# Altium project MCP2515 Module.PrjPcb
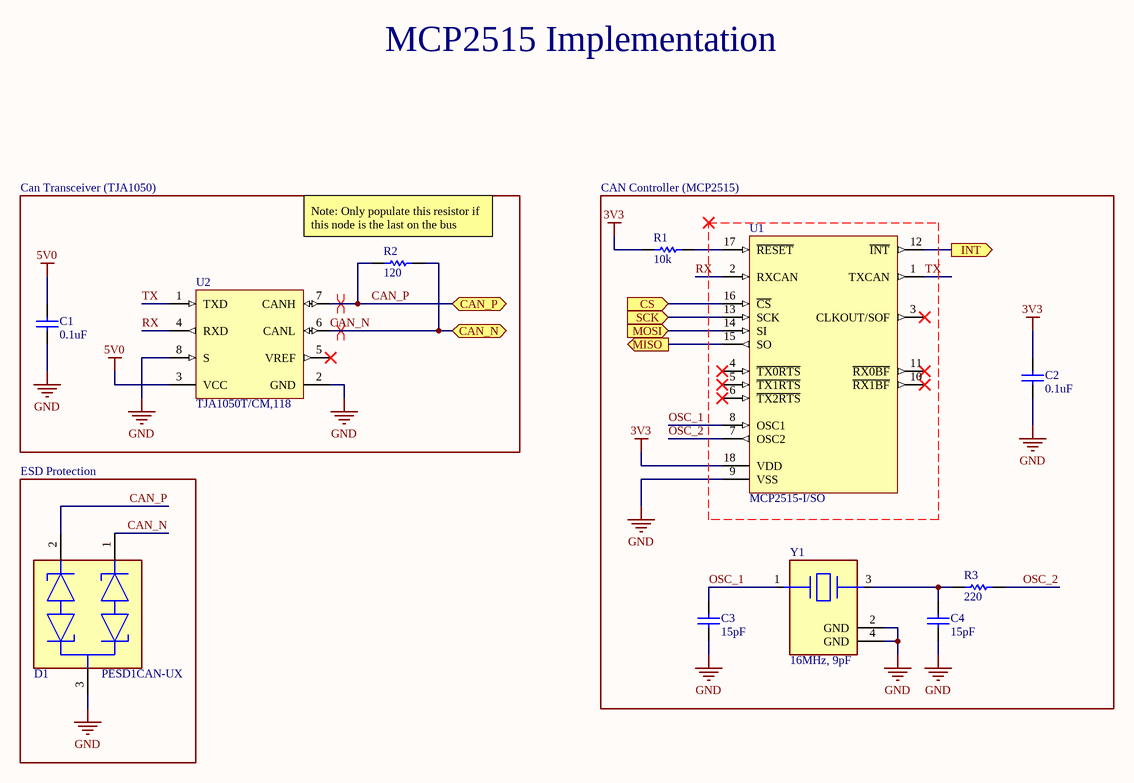
[diagram p0: MCP2515 Module.SchDoc]
1 sheet, 11 parts. Net scope: flat (ports and power ports of the same name join across sheets).

## Sheet MCP2515 Module.SchDoc
size A4

### Parts
C1  0.1uF  [CAPC2013X88X50NL20T25]
C2  0.1uF  [CAPC2013X88X50NL20T25]
C3  15pF  [CAPC2013X140X50LL20T25]
C4  15pF  [CAPC2013X140X50LL20T25]
D1  PESD1CAN-UX  [FP-SOT323-MFG]
R1  10k  [RESC2013X60X40LL20T25_A]
R2  120  [RESC2013X70X40NL20T20]
R3  220  [RESC2013X70X40NL20T20]
U1  MCP2515-I/SO  [SOIC-SO18_L]
U2  TJA1050T/CM,118  [NXP-SOT96-1_M]
Y1  16MHz, 9pF  [FP-TSX-3225-MFG]

### Blocks framed on the sheet
Can Transceiver (TJA1050): C1 R2 U2
CAN Controller (MCP2515): C2-C4 R1 R3 U1 Y1
ESD Protection: D1

### Ports
CAN_N (bidir), CAN_P (bidir), CS (in), INT (out), MISO (out), MOSI (in), SCK (in)

### Nets
3V3: C2.2 R1.1 U1.18(VDD)
5V0: C1.2 U2.3(VCC)
GND: C1.1 C2.1 C3.2 C4.2 D1.3(common_cathode) U1.9(VSS) U2.2(GND) U2.8(S) Y1.2(GND) Y1.4(GND)
CAN_N: D1.1(cathode_1) R2.2 U2.6(CANL) ; port CAN_N
CAN_P: D1.2(cathode_2) R2.1 U2.7(CANH) ; port CAN_P
OSC_1: C3.1 U1.8(OSC1) Y1.1
OSC_2: R3.1 U1.7(OSC2)
RX: U1.2(RXCAN) U2.4(RXD)
TX: U1.1(TXCAN) U2.1(TXD)
NetC4_1: C4.1 R3.2 Y1.3
NetR1_2: R1.2 U1.17(~{RESET})
NetU1_12: U1.12(~{INT}) ; port INT
NetU1_13: U1.13(SCK) ; port SCK
NetU1_14: U1.14(SI) ; port MOSI
NetU1_15: U1.15(SO) ; port MISO
NetU1_16: U1.16(~{CS}) ; port CS

Not connected (* = marked no-connect by the designer): U1 3(CLKOUT/SOF)* 4(~{TX0RTS})* 5(~{TX1RTS})* 6(~{TX2RTS})* 10(~{RX1BF})* 11(~{RX0BF})*; U2 5(VREF)*

### Layout directives
differential pair: CAN_N, CAN_P

### Notes on the sheet
- MCP2515 Implementation
- (near R2) Note: Only populate this resistor if this node is the last on the bus

### Library data of the parts
C1 C2 = CMP-2007-00279-1: Part Number: C0805C104K5RACTU; Manufacturer: Kemet; Dielectric Material: Ceramic; Capacitance: 100nF; Tolerance: 10%; Voltage Rating: 50V; Dielectric: X7R; Voltage: 500V; Supplier 1: LCSC; Supplier Part Number 1: C129690; Manufacturer Part Number: C0805C104K5RACTU; RoHS: Yes; Category: Ceramic Capacitors; Stock 1: 744050; Pricing 1: 50=0.02360, 500=0.01780, 1500=0.01680, 5000=0.01570, 25000=0.01530, 50000=0.01500, 50=0.02250, 500=0.01700, 1500=0.01600, 5000=0.01500, 25000=0.01460, 50000=0.01430, 50=0.11760, 500=0.08890, 1500=0.08370, 5000=0.07840, 25000=0.07610, 50000=0.07490, 50=0.10700, 500=0.08090, 1500=0.07610, 5000=0.07130, 25000=0.06920, 50000=0.06810, 50=0.01440, 500=0.01090, 1500=0.01020, 5000=0.00960, 25000=0.00930, 50000=0.00920, 50=0.01310, 500=0.00990, 1500=0.00930, 5000=0.00870, 25000=0.00850, 50000=0.00830, 50=0.13020, 500=0.09850, 1500=0.09270, 5000=0.08680, 25000=0.08420, 50000=0.08300, 50=1.77600, 500=1.34310, 1500=1.26360, 5000=1.18400, 25000=1.14870, 50000=1.13130, 50=0.07150, 500=0.05410, 1500=0.05090, 5000=0.04770, 25000=0.04620, 50000=0.04550, 50=1.20420, 500=0.91060, 1500=0.85670, 5000=0.80280, 25000=0.77880, 50000=0.76700, 50=0.14790, 500=0.11180, 1500=0.10520, 5000=0.09860, 25000=0.09570, 50000=0.09420, 50=0.02320, 500=0.01750, 1500=0.01650, 5000=0.01550, 25000=0.01500, 50000=0.01480, 50=0.01680, 500=0.01271, 1500=0.01196, 5000=0.01120, 25000=0.01087, 50000=0.01070 (AUD); Mount: Surface Mount,PCB; Case/Package: 0805; Number of Pins: 2; Case Code (Imperial): 0805; Case Code (Metric): 2012; Contact Plating: Tin,Matte; Min Operating Temperature: -55°C; Max Operating Temperature: 125°C; Packaging: Tape and Reel; Termination: SMD/SMT; Package Quantity: 4000; Voltage Rating (DC): 50V; Length: 2mm; Height: 0.9mm; Depth: 1.25mm; Width: 1.2mm; Thickness: 0.035inch; Lead Pitch: 0.75mm; Radiation Hardening: No; REACH SVHC: No SVHC; ComponentLink1URL: https://datasheet.ciiva.com/14589/70095383-14589048.pdf?src-supplier=Allied+Electronics; ComponentLink1Description: https://datasheet.ciiva.com/14589/70095383-14589048.pdf?src-supplier=Allied+Electronics; ComponentLink2URL: https://datasheet.ciiva.com/28682/1851736-28682232.pdf?src-supplier=Element14; ComponentLink2Description: https://datasheet.ciiva.com/28682/1851736-28682232.pdf?src-supplier=Element14; ComponentLink3URL: https://datasheet.ciiva.com/32431/slceramic-chip-condensers-e-32431755.pdf?src-supplier=Distrelec; ComponentLink3Description: https://datasheet.ciiva.com/32431/slceramic-chip-condensers-e-32431755.pdf?src-supplier=Distrelec; ComponentLink4URL: https://datasheet.ciiva.com/18410/70095383-18410815.pdf?src-supplier=Allied+Electronics; ComponentLink4Description: https://datasheet.ciiva.com/18410/70095383-18410815.pdf?src-supplier=Allied+Electronics; Supplier 2: Digi-Key; Supplier Part Number 2: 399-1170-1-ND; Stock 2: 2736847; Pricing 2: 1=0.16000, 10=0.11500, 50=0.06540, 100=0.05420, 500=0.03802, 1000=0.03147 (USD)
C3 C4 = CMP-2007-04621-1: Part Number: 08055A150JAT2A; Manufacturer: AVX Interconnect / Elco; Dielectric Material: Ceramic; Voltage Rating: 50V; Tolerance: 5%; Dielectric: C0G; Temperature Coefficient: 0ppm/°C; Supplier 1: LCSC; Supplier Part Number 1: C597359; Manufacturer Part Number: 08055A150JAT2A; RoHS: Yes; Category: Ceramic Capacitors; Stock 1: 3620; Pricing 1: 20=0.03110, 200=0.02350, 600=0.02210, 2000=0.02070, 10000=0.02010, 20000=0.01980, 20=0.02970, 200=0.02250, 600=0.02110, 2000=0.01980, 10000=0.01920, 20000=0.01890, 20=0.15140, 200=0.11430, 600=0.10750, 2000=0.10070, 10000=0.09770, 20000=0.09620, 20=0.14090, 200=0.10640, 600=0.10010, 2000=0.09370, 10000=0.09090, 20000=0.08950, 20=0.01890, 200=0.01430, 600=0.01340, 2000=0.01260, 10000=0.01220, 20000=0.01200, 20=0.01730, 200=0.01300, 600=0.01230, 2000=0.01150, 10000=0.01110, 20000=0.01100, 20=0.17220, 200=0.13010, 600=0.12230, 2000=0.11460, 10000=0.11110, 20000=0.10940, 20=2.34860, 200=1.77360, 600=1.66800, 2000=1.56230, 10000=1.51540, 20000=1.49220, 20=0.09240, 200=0.06980, 600=0.06560, 2000=0.06140, 10000=0.05960, 20000=0.05870, 20=1.75290, 200=1.32370, 600=1.24490, 2000=1.16600, 10000=1.13100, 20000=1.11370, 20=0.19920, 200=0.15040, 600=0.14140, 2000=0.13250, 10000=0.12850, 20000=0.12650, 20=0.03040, 200=0.02300, 600=0.02160, 2000=0.02020, 10000=0.01960, 20000=0.01930, 20=0.02222, 200=0.01678, 600=0.01578, 2000=0.01478, 10000=0.01434, 20000=0.01412 (AUD); Mount: Surface Mount,PCB; Case/Package: 0805; Number of Pins: 2; Case Code (Metric): 2012; Case Code (Imperial): 0805; Contact Plating: Tin,Matte; Min Operating Temperature: -55°C; Max Operating Temperature: 125°C; Capacitance: 15pF; Packaging: Tape and Reel; Voltage Rating (DC): 50V; Package Quantity: 1; Termination: SMD/SMT; Voltage: 50V; Length: 2.01mm; Height: 0.71mm; Depth: 1.25mm; Width: 0.049inch; Thickness: 0.037inch; Radiation Hardening: No; Lead Free: Lead Free; REACH SVHC: No SVHC; ComponentLink1URL: https://datasheet.ciiva.com/150/ccog-150608.pdf?src-supplier=Digi-Key; ComponentLink1Description: https://datasheet.ciiva.com/150/ccog-150608.pdf?src-supplier=Digi-Key; ComponentLink2URL: https://datasheet.ciiva.com/150/ccog-150609.pdf?src-supplier=Digi-Key; ComponentLink2Description: https://datasheet.ciiva.com/150/ccog-150609.pdf?src-supplier=Digi-Key; ComponentLink3URL: https://datasheet.ciiva.com/150/ccog-150610.pdf?src-supplier=Digi-Key; ComponentLink3Description: https://datasheet.ciiva.com/150/ccog-150610.pdf?src-supplier=Digi-Key; ComponentLink4URL: https://datasheet.ciiva.com/16537/ccog-16537029.pdf?src-supplier=Avnet+Asia; ComponentLink4Description: https://datasheet.ciiva.com/16537/ccog-16537029.pdf?src-supplier=Avnet+Asia; ComponentLink5URL: https://datasheet.ciiva.com/22676/759117-22676981.pdf?src-supplier=Element14; ComponentLink5Description: https://datasheet.ciiva.com/22676/759117-22676981.pdf?src-supplier=Element14; ComponentLink6URL: https://datasheet.ciiva.com/2987/ccog-2987979.pdf?src-supplier=Avnet; ComponentLink6Description: https://datasheet.ciiva.com/2987/ccog-2987979.pdf?src-supplier=Avnet; ComponentLink7URL: https://datasheet.ciiva.com/17492/ccog-17492987.pdf?src-supplier=Avnet+Europe; ComponentLink7Description: https://datasheet.ciiva.com/17492/ccog-17492987.pdf?src-supplier=Avnet+Europe; ComponentLink8URL: https://datasheet.ciiva.com/7812/759117-7812028.pdf?src-supplier=Element14; ComponentLink8Description: https://datasheet.ciiva.com/7812/759117-7812028.pdf?src-supplier=Element14; ComponentLink9URL: https://datasheet.ciiva.com/14592/70001039-14592399.pdf?src-supplier=Allied+Electronics; ComponentLink9Description: https://datasheet.ciiva.com/14592/70001039-14592399.pdf?src-supplier=Allied+Electronics; Supplier 2: Digi-Key; Supplier Part Number 2: 478-1306-1-ND; Stock 2: 2221; Pricing 2: 1=0.14000, 10=0.10200, 50=0.05780, 100=0.04790, 500=0.03356, 1000=0.02778 (USD)
D1 = CMP-14436-000006-1: TVS DIODE 24V 50V SC70-3; Manufacturer: Nexperia; Supplier Part Number 1: C152727; Supplier 1: LCSC; Supplier 2: Digi-Key; Supplier Part Number 2: 1727-1306-1-ND; Manufacturer Part Number: PESD1CAN-UX; RoHS: No; Category: ESD and Circuit Protection ICs; Stock 2: 174859; Pricing 2: 1=0.38000, 10=0.25600, 100=0.15110, 500=0.10230, 1000=0.08138 (USD); ComponentLink1URL: https://www.mouser.com/ds/2/302/PESD1CAN-U-1151714.pdf?src-supplier=Mouser; ComponentLink1Description: https://www.mouser.com/ds/2/302/PESD1CAN-U-1151714.pdf?src-supplier=Mouser; ComponentLink2URL: http://www.farnell.com/datasheets/1738911.pdf?src-supplier=Farnell; ComponentLink2Description: http://www.farnell.com/datasheets/1738911.pdf?src-supplier=Farnell; ComponentLink3URL: http://www.farnell.com/datasheets/1738911.pdf?src-supplier=Newark; ComponentLink3Description: http://www.farnell.com/datasheets/1738911.pdf?src-supplier=Newark; ComponentLink4URL: https://assets.nexperia.com/documents/data-sheet/PESD1CAN-U.pdf?src-supplier=Digi-Key; ComponentLink4Description: https://assets.nexperia.com/documents/data-sheet/PESD1CAN-U.pdf?src-supplier=Digi-Key; ComponentLink5URL: http://www.farnell.com/datasheets/1738911.pdf?src-supplier=Element14; ComponentLink5Description: http://www.farnell.com/datasheets/1738911.pdf?src-supplier=Element14
R1 = CMP-2000-06228-1: Metal Film Chip Resistor, High Reliability Type, 0.125 W, +/- 0.1%, -55 to 155 degC, 0805 (2012 Metric), RoHS, Tape and Reel; Manufacturer Part Number: ERA-6AEB103V; Voltage Rating: 100V; Power Rating: 125mW(1/8W); Brand: Panasonic; Temperature Coefficient: 25PPM/C; Resistance: 10kOhms; Max Power Dissipation: 125mW; Product Category: ThinFilmResistors-SMD; Datasheet Version: 02/2016; Operating Temperature Range: -55Cto+155C; Length: 2mm; Mounting Technology: SurfaceMount; Manufacturer URL: http://www.panasonic.com/; Width: 1.25mm; Packaging: Reel; Product: ThinFilmResistorsSMD; Package / Case: 0805(2012metric); Termination Style: SMD/SMT; Tolerance: 0.1%; Datasheet URL: https://industrial.panasonic.com/cdbs/www-data/pdf/RDM0000/AOA0000C307.pdf; Package Description: 2-Pin Surface Mount Device, Body 2 x 1.25 mm; Factory Pack Quantity: 5000; Series: ERA-6A; Case Code - mm: 2012; RoHS: Details; Package Reference: 0805; Height: 0.5mm; Manufacturer: Panasonic; Case Code - in: 0805; Type: MetalFilmChipResistors; Supplier 1: LCSC; Supplier Part Number 1: C191101; Category: Chip SMD Resistors; Stock 1: 8630; Pricing 1: 5=0.09860, 50=0.07220, 150=0.06730, 500=0.06250, 2500=0.06030, 5000=0.05930, 5=0.09410, 50=0.06890, 150=0.06430, 500=0.05960, 2500=0.05760, 5000=0.05660, 5=0.49190, 50=0.36010, 150=0.33590, 500=0.31170, 2500=0.30090, 5000=0.29560, 5=0.44730, 50=0.32750, 150=0.30540, 500=0.28340, 2500=0.27360, 5000=0.26880, 5=0.06010, 50=0.04400, 150=0.04100, 500=0.03810, 2500=0.03680, 5000=0.03610, 5=0.05480, 50=0.04010, 150=0.03740, 500=0.03470, 2500=0.03350, 5000=0.03290, 5=0.54470, 50=0.39880, 150=0.37200, 500=0.34510, 2500=0.33320, 5000=0.32730, 5=7.42750, 50=5.43740, 150=5.07190, 500=4.70630, 2500=4.54380, 5000=4.46360, 5=0.29900, 50=0.21890, 150=0.20420, 500=0.18950, 2500=0.18290, 5000=0.17970, 5=5.03590, 50=3.68660, 150=3.43870, 500=3.19090, 2500=3.08070, 5000=3.02630, 5=0.61850, 50=0.45280, 150=0.42240, 500=0.39190, 2500=0.37840, 5000=0.37170, 5=0.09700, 50=0.07100, 150=0.06620, 500=0.06150, 2500=0.05930, 5000=0.05830, 5=0.07027, 50=0.05144, 150=0.04799, 500=0.04453, 2500=0.04299, 5000=0.04223 (AUD); Mount: Surface Mount; Case/Package: 0805; Number of Pins: 2; Case Code (Metric): 2012; Case Code (Imperial): 0805; Contact Plating: Tin; Min Operating Temperature: -55°C; Max Operating Temperature: 155°C; Composition: Thin Film,Metal Film; Termination: SMD/SMT; Voltage Rating (DC): 100V; Package Quantity: 5000; Number of Terminations: 2; Military Standard: Not; Working Voltage: 100V; Depth: 1.25mm; Radiation Hardening: No; Lead Free: Lead Free; REACH SVHC: No SVHC; ComponentLink1URL: https://datasheet.ciiva.com/11810/0900766b80beefcc-11810466.pdf?src-supplier=RSComponents; ComponentLink1Description: https://datasheet.ciiva.com/11810/0900766b80beefcc-11810466.pdf?src-supplier=RSComponents; ComponentLink2URL: https://datasheet.ciiva.com/26335/453339-da-01-en-widerstand-0805-era-26335701.pdf?src-supplier=Conrad; ComponentLink2Description: https://datasheet.ciiva.com/26335/453339-da-01-en-widerstand-0805-era-26335701.pdf?src-supplier=Conrad; ComponentLink3URL: https://datasheet.ciiva.com/43455/485442-43455269.pdf?src-supplier=Farnell; ComponentLink3Description: https://datasheet.ciiva.com/43455/485442-43455269.pdf?src-supplier=Farnell; ComponentLink4URL: https://datasheet.ciiva.com/28513/485442-28513862.pdf?src-supplier=Element14; ComponentLink4Description: https://datasheet.ciiva.com/28513/485442-28513862.pdf?src-supplier=Element14; ComponentLink5URL: https://datasheet.ciiva.com/24072/aoa0000ce26-197354-24072839.pdf?src-supplier=Mouser; ComponentLink5Description: https://datasheet.ciiva.com/24072/aoa0000ce26-197354-24072839.pdf?src-supplier=Mouser; ComponentLink6URL: https://datasheet.ciiva.com/48529/era-eng-tds-48529783.pdf?src-supplier=Distrelec; ComponentLink6Description: https://datasheet.ciiva.com/48529/era-eng-tds-48529783.pdf?src-supplier=Distrelec; ComponentLink7URL: https://datasheet.ciiva.com/48531/aoa0000ce26-48531095.pdf?src-supplier=Avnet; ComponentLink7Description: https://datasheet.ciiva.com/48531/aoa0000ce26-48531095.pdf?src-supplier=Avnet; ComponentLink8URL: https://datasheet.ciiva.com/16200/aoa0000ce26-16200216.pdf?src-supplier=Future+Electronics; ComponentLink8Description: https://datasheet.ciiva.com/16200/aoa0000ce26-16200216.pdf?src-supplier=Future+Electronics; ComponentLink9URL: https://datasheet.ciiva.com/16776/70068849-16776328.pdf?src-supplier=Allied+Electronics; ComponentLink9Description: https://datasheet.ciiva.com/16776/70068849-16776328.pdf?src-supplier=Allied+Electronics; ComponentLink10URL: https://datasheet.ciiva.com/16762/70068849-16762828.pdf?src-supplier=Allied+Electronics; ComponentLink10Description: https://datasheet.ciiva.com/16762/70068849-16762828.pdf?src-supplier=Allied+Electronics; ComponentLink11URL: https://datasheet.ciiva.com/7830/485442-7830637.pdf?src-supplier=Element14; ComponentLink11Description: https://datasheet.ciiva.com/7830/485442-7830637.pdf?src-supplier=Element14; ComponentLink12URL: https://datasheet.ciiva.com/7830/485442-7830638.pdf?src-supplier=Element14; ComponentLink12Description: https://datasheet.ciiva.com/7830/485442-7830638.pdf?src-supplier=Element14; ComponentLink13URL: https://datasheet.ciiva.com/7830/485442-7830639.pdf?src-supplier=Element14; ComponentLink13Description: https://datasheet.ciiva.com/7830/485442-7830639.pdf?src-supplier=Element14; ComponentLink14URL: https://datasheet.ciiva.com/22785/485442-22785935.pdf?src-supplier=Farnell; ComponentLink14Description: https://datasheet.ciiva.com/22785/485442-22785935.pdf?src-supplier=Farnell; Supplier 2: Digi-Key; Supplier Part Number 2: P10KDADKR-ND; Stock 2: 145856; Pricing 2: 1=0.33000, 10=0.27800, 100=0.10850, 1000=0.04541, 2500=0.04163 (USD)
R2 = CMP-1665-00010-4: Chip Resistor, 120 Ohm, +/- 1%, 0.125 W, -55 to 155 degC, 0805 (2012 Metric), RoHS, Tape and Reel; Manufacturer: Panasonic; Manufacturer Part Number: ERJ-6ENF1200V; Voltage Rating: 150 V; Resistance: 120R; Temperature Coefficient: 100ppm/°C; Power Rating: 125mW; Voltage Rating (DC): 150V; Mount: Surface Mount; ComponentLink1Description: Manufacturer URL; ComponentLink1URL: http://www.panasonic.com/; RoHSCompliant: true; Min Operating Temperature: -55 degC; Length: 2 mm; Max Operating Temperature: 155 degC; Packaging: Tape and Reel; Package Quantity: 5000; REACH SVHC: Yes; Pins: 2; ComponentLink2Description: Datasheet; DatasheetVersion: 04/2015; PackageReference: 0805; ComponentLink2URL: http://industrial.panasonic.com/cdbs/www-data/pdf/RDA0000/AOA0000C86.pdf; Mounting Technology: Surface Mount; PackageDescription: 2-Pin Surface Mount Device, Body 2 x 1.25 mm; Height: 0.6 mm; Supplier 1: LCSC; Supplier Part Number 1: C409952; RoHS: Yes; Category: Chip SMD Resistors; Stock 1: 13050; Pricing 1: 50=0.01500, 500=0.01100, 1500=0.01030, 5000=0.00950, 25000=0.00920, 50000=0.00910, 50=0.01430, 500=0.01050, 1500=0.00980, 5000=0.00910, 25000=0.00880, 50000=0.00860, 50=0.07490, 500=0.05490, 1500=0.05130, 5000=0.04760, 25000=0.04600, 50000=0.04520, 50=0.06810, 500=0.04990, 1500=0.04660, 5000=0.04330, 25000=0.04180, 50000=0.04110, 50=0.00910, 500=0.00670, 1500=0.00630, 5000=0.00580, 25000=0.00560, 50000=0.00550, 50=0.00830, 500=0.00610, 1500=0.00570, 5000=0.00530, 25000=0.00510, 50000=0.00500, 50=0.08290, 500=0.06080, 1500=0.05680, 5000=0.05270, 25000=0.05090, 50000=0.05000, 50=1.13040, 500=0.82940, 1500=0.77410, 5000=0.71880, 25000=0.69430, 50000=0.68220, 50=0.04550, 500=0.03340, 1500=0.03120, 5000=0.02890, 25000=0.02800, 50000=0.02750, 50=0.76640, 500=0.56230, 1500=0.52490, 5000=0.48740, 25000=0.47080, 50000=0.46250, 50=0.09410, 500=0.06910, 1500=0.06450, 5000=0.05990, 25000=0.05780, 50000=0.05680, 50=0.01480, 500=0.01080, 1500=0.01010, 5000=0.00940, 25000=0.00910, 50000=0.00890, 50=0.01070, 500=0.00785, 1500=0.00732, 5000=0.00680, 25000=0.00657, 50000=0.00645 (AUD); Case/Package: 0805; Number of Pins: 2; Case Code (Imperial): 0805; Case Code (Metric): 2012; Contact Plating: Tin; Tolerance: 1%; Composition: Thick Film; Termination: SMD/SMT; Number of Terminations: 2; Military Standard: Not; Max Power Dissipation: 125mW; Features: Automotive AEC-Q200; Width: 1.2mm; Depth: 1.25mm; Radiation Hardening: No; Lead Free: Lead Free; ComponentLink3URL: https://datasheet.ciiva.com/11821/0900766b80f80784-11821533.pdf?src-supplier=RSComponents; ComponentLink3Description: https://datasheet.ciiva.com/11821/0900766b80f80784-11821533.pdf?src-supplier=RSComponents; ComponentLink4URL: https://datasheet.ciiva.com/22673/1678782-22673701.pdf?src-supplier=Element14; ComponentLink4Description: https://datasheet.ciiva.com/22673/1678782-22673701.pdf?src-supplier=Element14; ComponentLink5URL: https://datasheet.ciiva.com/15158/getdatasheetpartid-248620-15158999.pdf?src-supplier=Verical; ComponentLink5Description: https://datasheet.ciiva.com/15158/getdatasheetpartid-248620-15158999.pdf?src-supplier=Verical; ComponentLink6URL: https://datasheet.ciiva.com/16782/70260748-16782215.pdf?src-supplier=Allied+Electronics; ComponentLink6Description: https://datasheet.ciiva.com/16782/70260748-16782215.pdf?src-supplier=Allied+Electronics; ComponentLink7URL: https://datasheet.ciiva.com/24069/aoa0000ce2-24069192.pdf?src-supplier=Mouser; ComponentLink7Description: https://datasheet.ciiva.com/24069/aoa0000ce2-24069192.pdf?src-supplier=Mouser; ComponentLink8URL: https://datasheet.ciiva.com/46373/1678782-46373272.pdf?src-supplier=Element14; ComponentLink8Description: https://datasheet.ciiva.com/46373/1678782-46373272.pdf?src-supplier=Element14; ComponentLink9URL: https://datasheet.ciiva.com/46373/1678782-46373273.pdf?src-supplier=Element14; ComponentLink9Description: https://datasheet.ciiva.com/46373/1678782-46373273.pdf?src-supplier=Element14; ComponentLink10URL: https://datasheet.ciiva.com/17207/aoa0000ce2-17207722.pdf?src-supplier=Avnet+Europe; ComponentLink10Description: https://datasheet.ciiva.com/17207/aoa0000ce2-17207722.pdf?src-supplier=Avnet+Europe; ComponentLink11URL: https://datasheet.ciiva.com/6082/426256-6082139.pdf?src-supplier=Farnell; ComponentLink11Description: https://datasheet.ciiva.com/6082/426256-6082139.pdf?src-supplier=Farnell; ComponentLink12URL: https://datasheet.ciiva.com/22687/1678782-22687419.pdf?src-supplier=Element14; ComponentLink12Description: https://datasheet.ciiva.com/22687/1678782-22687419.pdf?src-supplier=Element14; ComponentLink13URL: https://datasheet.ciiva.com/7886/426256-7886749.pdf?src-supplier=Element14; ComponentLink13Description: https://datasheet.ciiva.com/7886/426256-7886749.pdf?src-supplier=Element14; ComponentLink14URL: https://datasheet.ciiva.com/9117/aoa0000ce2-9117405.pdf?src-supplier=Avnet; ComponentLink14Description: https://datasheet.ciiva.com/9117/aoa0000ce2-9117405.pdf?src-supplier=Avnet; ComponentLink15URL: https://datasheet.ciiva.com/16765/70260748-16765246.pdf?src-supplier=Allied+Electronics; ComponentLink15Description: https://datasheet.ciiva.com/16765/70260748-16765246.pdf?src-supplier=Allied+Electronics; ComponentLink16URL: https://datasheet.ciiva.com/16514/aoa0000ce2-16514031.pdf?src-supplier=Avnet+Asia; ComponentLink16Description: https://datasheet.ciiva.com/16514/aoa0000ce2-16514031.pdf?src-supplier=Avnet+Asia; Supplier 2: Digi-Key; Supplier Part Number 2: P120CCT-ND; Stock 2: 93387; Pricing 2: 1=0.10000, 10=0.07200, 100=0.02750, 1000=0.01210, 2500=0.01045 (USD)
R3 = CMP-2001-00044-1: Part Number: ERJ6ENF2200V; Manufacturer: Panasonic; Manufacturer Part Number: ERJ-6ENF2200V; Resistance: 220R; Tolerance: 1%; Temperature Coefficient: 100ppm/°C; Power Rating: 125mW; Voltage Rating: 150V; Supplier 1: Digi-Key; Supplier Part Number 1: P220CCT-ND; RoHS: Yes; Category: Chip SMD Resistors; Stock 1: 108553; Pricing 1: 1=0.10000, 10=0.07200, 100=0.02750, 1000=0.01210, 2500=0.01045 (USD); Mount: Surface Mount; Case/Package: 0805; Number of Pins: 2; Case Code (Imperial): 0805; Case Code (Metric): 2012; Contact Plating: Tin; Min Operating Temperature: -55°C; Max Operating Temperature: 155°C; Packaging: Tape and Reel; Composition: Thick Film; Termination: SMD/SMT; Voltage Rating (DC): 150V; Package Quantity: 1; Number of Terminations: 2; Max Power Dissipation: 125mW; Military Standard: Not; Features: Automotive AEC-Q200; Length: 2mm; Height: 0.6mm; Width: 1.2mm; Depth: 1.25mm; Radiation Hardening: No; Lead Free: Lead Free; REACH SVHC: No SVHC; ComponentLink1URL: https://datasheet.ciiva.com/11821/0900766b80f80784-11821561.pdf?src-supplier=RSComponents; ComponentLink1Description: https://datasheet.ciiva.com/11821/0900766b80f80784-11821561.pdf?src-supplier=RSComponents; ComponentLink2URL: https://datasheet.ciiva.com/26914/getdatasheetpartid-123856-26914677.pdf?src-supplier=Verical; ComponentLink2Description: https://datasheet.ciiva.com/26914/getdatasheetpartid-123856-26914677.pdf?src-supplier=Verical; ComponentLink3URL: https://datasheet.ciiva.com/43511/aoa0000ce2-43511461.pdf?src-supplier=Onlinecomponents.com; ComponentLink3Description: https://datasheet.ciiva.com/43511/aoa0000ce2-43511461.pdf?src-supplier=Onlinecomponents.com; ComponentLink4URL: https://datasheet.ciiva.com/7887/426256-7887031.pdf?src-supplier=Element14; ComponentLink4Description: https://datasheet.ciiva.com/7887/426256-7887031.pdf?src-supplier=Element14; ComponentLink5URL: https://datasheet.ciiva.com/28568/1678782-28568983.pdf?src-supplier=Element14; ComponentLink5Description: https://datasheet.ciiva.com/28568/1678782-28568983.pdf?src-supplier=Element14; ComponentLink6URL: https://datasheet.ciiva.com/16771/70260748-16771368.pdf?src-supplier=Allied+Electronics; ComponentLink6Description: https://datasheet.ciiva.com/16771/70260748-16771368.pdf?src-supplier=Allied+Electronics; ComponentLink7URL: https://datasheet.ciiva.com/16784/70260748-16784746.pdf?src-supplier=Allied+Electronics; ComponentLink7Description: https://datasheet.ciiva.com/16784/70260748-16784746.pdf?src-supplier=Allied+Electronics; ComponentLink8URL: https://datasheet.ciiva.com/22668/1678782-22668331.pdf?src-supplier=Element14; ComponentLink8Description: https://datasheet.ciiva.com/22668/1678782-22668331.pdf?src-supplier=Element14; ComponentLink9URL: https://datasheet.ciiva.com/9184/aoa0000ce2-9184302.pdf?src-supplier=Avnet; ComponentLink9Description: https://datasheet.ciiva.com/9184/aoa0000ce2-9184302.pdf?src-supplier=Avnet; Supplier 2: LCSC; Supplier Part Number 2: C413269; Stock 2: 1550; Pricing 2: 50=0.01470, 500=0.01080, 1500=0.01000, 5000=0.00930, 25000=0.00900, 50000=0.00880, 50=0.01370, 500=0.01000, 1500=0.00940, 5000=0.00870, 25000=0.00840, 50000=0.00820, 50=0.07160, 500=0.05230, 1500=0.04880, 5000=0.04530, 25000=0.04370, 50000=0.04290, 50=0.06700, 500=0.04900, 1500=0.04570, 5000=0.04240, 25000=0.04090, 50000=0.04020, 50=0.00900, 500=0.00660, 1500=0.00610, 5000=0.00570, 25000=0.00550, 50000=0.00540, 50=0.00810, 500=0.00590, 1500=0.00550, 5000=0.00510, 25000=0.00490, 50000=0.00480, 50=0.07830, 500=0.05720, 1500=0.05330, 5000=0.04950, 25000=0.04780, 50000=0.04690, 50=1.07840, 500=0.78820, 1500=0.73490, 5000=0.68170, 25000=0.65790, 50000=0.64620, 50=0.04320, 500=0.03160, 1500=0.02950, 5000=0.02730, 25000=0.02640, 50000=0.02590, 50=0.70440, 500=0.51490, 1500=0.48010, 5000=0.44530, 25000=0.42980, 50000=0.42210, 50=0.09440, 500=0.06900, 1500=0.06430, 5000=0.05970, 25000=0.05760, 50000=0.05660, 50=0.01410, 500=0.01030, 1500=0.00960, 5000=0.00890, 25000=0.00860, 50000=0.00840, 50=0.01010, 500=0.00738, 1500=0.00688, 5000=0.00638, 25000=0.00616, 50000=0.00605 (AUD)
U1 = CMP-0186-00133-2: Stand-Alone CAN Controller With SPI Interface, 18-Pin SOIC, Industrial Temperature; Manufacturer: Microchip; Interface: SPI,CAN; Min Supply Voltage: 2.7V; Max Supply Voltage: 5.5V; Number of Transceivers: 1; Data Rate: 1Mbps; Max Supply Current: 10mA; Operating Supply Voltage: 5V; Number of Transmit Buffers: 3; Number of Receive Buffers: 2; Frequency: 40MHz; ComponentLink2Description: Datasheet; RevisionNote: URLs added. DatasheetVersion updated.; PackageVersion: revBB, Aug-2009; ComponentLink1URL: http://www.microchip.com/; PackageReference: SOIC-SO18; PackageDescription: 18-Lead Plastic Small Outline (SO) - Wide 7.50mm Body [SOIC]; DatasheetVersion: revF, Oct-2010; ComponentLink2URL: http://ww1.microchip.com/downloads/en/DeviceDoc/21801f.pdf; ComponentLink3URL: http://www.microchip.com/stellent/groups/techpub_sg/documents/packagingspec/en012702.pdf; Code_JEDEC: MS-013; ComponentLink3Description: Package Specification; ComponentLink1Description: Manufacturer URL; Supplier 1: Digi-Key; Supplier Part Number 1: MCP2515-I/SO-ND; Manufacturer Part Number: MCP2515-I/SO; RoHS: Yes; Category: Interface ICs; Stock 1: 3428; Pricing 1: 1=1.82000, 25=1.51000, 100=1.38000 (USD); Mount: Surface Mount; Case/Package: SOIC; Number of Pins: 18; Contact Plating: Tin,Matte; Min Operating Temperature: -40°C; Max Operating Temperature: 85°C; Packaging: Rail/Tube; Nominal Supply Current: 10mA; Number of Drivers: 1; Number of Receivers: 1; Length: 11.53mm; Height: 2.31mm; Width: 7.49mm; Radiation Hardening: No; Lead Free: Lead Free; REACH SVHC: No SVHC; ComponentLink4URL: https://datasheet.ciiva.com/14152/ea644222-e-14152533.pdf?src-supplier=Distrelec; ComponentLink4Description: https://datasheet.ciiva.com/14152/ea644222-e-14152533.pdf?src-supplier=Distrelec; ComponentLink5URL: https://datasheet.ciiva.com/15150/getdatasheetpartid-446809-15150054.pdf?src-supplier=Verical; ComponentLink5Description: https://datasheet.ciiva.com/15150/getdatasheetpartid-446809-15150054.pdf?src-supplier=Verical; ComponentLink6URL: https://datasheet.ciiva.com/16205/filehandler-aspxddocname-en011733-16205222.pdf?src-supplier=Future+Electronics; ComponentLink6Description: https://datasheet.ciiva.com/16205/filehandler-aspxddocname-en011733-16205222.pdf?src-supplier=Future+Electronics; ComponentLink7URL: https://datasheet.ciiva.com/18405/70045398-18405546.pdf?src-supplier=Allied+Electronics; ComponentLink7Description: https://datasheet.ciiva.com/18405/70045398-18405546.pdf?src-supplier=Allied+Electronics; ComponentLink8URL: https://datasheet.ciiva.com/1495/1669372-1495083.pdf?src-supplier=Element14; ComponentLink8Description: https://datasheet.ciiva.com/1495/1669372-1495083.pdf?src-supplier=Element14; ComponentLink9URL: https://datasheet.ciiva.com/1695/21801g-1695405.pdf?src-supplier=Digi-Key; ComponentLink9Description: https://datasheet.ciiva.com/1695/21801g-1695405.pdf?src-supplier=Digi-Key; ComponentLink10URL: https://datasheet.ciiva.com/29305/651448-da-01-en-ic-can-cont-mcp2515-i-so-soic-18-mcp-29305158.pdf?src-supplier=Conrad; ComponentLink10Description: https://datasheet.ciiva.com/29305/651448-da-01-en-ic-can-cont-mcp2515-i-so-soic-18-mcp-29305158.pdf?src-supplier=Conrad; Supplier 2: LCSC; Supplier Part Number 2: C12368; Stock 2: 6695; Pricing 2: 1=2.12140, 10=1.58340, 30=1.48520, 100=1.38690, 500=1.34250, 1000=1.32150, 1=2.02460, 10=1.51120, 30=1.41740, 100=1.32370, 500=1.28130, 1000=1.26120, 1=10.58150, 10=7.89820, 30=7.40820, 100=6.91820, 500=6.69660, 1000=6.59160, 1=9.62230, 10=7.18230, 30=6.73670, 100=6.29110, 500=6.08950, 1000=5.99410, 1=1.29280, 10=0.96500, 30=0.90510, 100=0.84530, 500=0.81820, 1000=0.80540, 1=1.17830, 10=0.87950, 30=0.82490, 100=0.77040, 500=0.74570, 1000=0.73400, 1=11.71760, 10=8.74620, 30=8.20360, 100=7.66100, 500=7.41560, 1000=7.29930, 1=159.77860, 10=119.26140, 30=111.86260, 100=104.46380, 500=101.11680, 1000=99.53140, 1=6.43290, 10=4.80160, 30=4.50370, 100=4.20590, 500=4.07110, 1000=4.00730, 1=108.33060, 10=80.85970, 30=75.84330, 100=70.82690, 500=68.55760, 1000=67.48270, 1=13.30580, 10=9.93170, 30=9.31550, 100=8.69940, 500=8.42060, 1000=8.28860, 1=2.08690, 10=1.55770, 30=1.46110, 100=1.36440, 500=1.32070, 1000=1.30000, 1=1.51167, 10=1.12833, 30=1.05833, 100=0.98833, 500=0.95667, 1000=0.94167 (AUD)
U2 = CMP-2000-04923-1: High speed CAN transceiver, 4.75 to 5.25 V, -40 to 150 degC, 8-Pin SO (SOT96-1), RoHS, Tape and Reel; Manufacturer: NXP Semiconductors; Duplex: Half; Number of Drivers/Receivers: 1/1; Product Training Modules: CANandLINBusTransceiver; Receiver Hysteresis: 70mV; Voltage - Supply: 4.75V~5.25V; Dynamic Catalog: CANTransceivers; Other Names: 568-10292-1; PCN Packaging: LighterPackingReels30/Mar/2014; PCN Obsolescence: TJA105028/Apr/2013 / MultipleDevices19/Apr/2013; Max Supply Voltage: 5.25V; Min Supply Voltage: 4.75V; Number of Transceivers: 1; Max Supply Current: 10mA; Data Rate: 1Mbps; Simplex/Duplex: Half Duplex; Standard Package: 1; Family: Interface-Drivers,Receivers,Transceivers; Package Reference: SOT96-1; Mounting Type: SurfaceMount; Package / Case: 8-SOIC(0.154",3.90mmWidth); Package Description: 8-Pin Small Outline Integrated Circuit, Body 4.9 x 3.9 mm, Pitch 1.27 mm; Protocol: CAN; Package/Case: 8-SOIC(0.154",3.90mmWidth); Supplier Device Package: 8-SO; <PCN>: http://media.digikey.com/pdf/PCNs/NXP/201209019F04_TJA1050_Obs.pdf; Minimum Quantity: Transceiver; Datasheet URL: http://www.nxp.com/documents/data_sheet/TJA1050.pdf; Category: IntegratedCircuits(ICs); Quantity Available: CutTape(CT)AlternatePackaging; Datasheet Version: Rev. 4, 10/2003; Type: Transceiver; Packaging: CutTape(CT); Manufacturer URL: http://www.nxp.com/; Supplier 1: LCSC; Supplier Part Number 1: C6952; Manufacturer Part Number: TJA1050T/CM,118; RoHS: Yes; Stock 1: 6230; Pricing 1: 1=0.78820, 10=0.57770, 30=0.54030, 100=0.50050, 500=0.47480, 1000=0.47250, 1=0.75220, 10=0.55130, 30=0.51560, 100=0.47770, 500=0.45310, 1000=0.45090, 1=3.93160, 10=2.88160, 30=2.69500, 100=2.49660, 500=2.36830, 1000=2.35660, 1=3.57520, 10=2.62040, 30=2.45070, 100=2.27030, 500=2.15360, 1000=2.14300, 1=0.48040, 10=0.35210, 30=0.32930, 100=0.30500, 500=0.28940, 1000=0.28790, 1=0.43780, 10=0.32090, 30=0.30010, 100=0.27800, 500=0.26370, 1000=0.26240, 1=4.35370, 10=3.19100, 30=2.98430, 100=2.76470, 500=2.62260, 1000=2.60970, 1=59.36650, 10=43.51200, 30=40.69330, 100=37.69860, 500=35.76080, 1000=35.58470, 1=2.39020, 10=1.75180, 30=1.63840, 100=1.51780, 500=1.43980, 1000=1.43270, 1=40.25070, 10=29.50130, 30=27.59030, 100=25.55980, 500=24.24600, 1000=24.12660, 1=4.94380, 10=3.62350, 30=3.38880, 100=3.13940, 500=2.97800, 1000=2.96340, 1=0.77540, 10=0.56830, 30=0.53150, 100=0.49240, 500=0.46710, 1000=0.46480, 1=0.56167, 10=0.41167, 30=0.38500, 100=0.35667, 500=0.33833, 1000=0.33667 (AUD); Mount: Surface Mount; Case/Package: SO; Number of Pins: 8; Contact Plating: Gold,Silver; Min Operating Temperature: -40°C; Max Operating Temperature: 150°C; Package Quantity: 2500; Nominal Supply Current: 10mA; Interface: CAN; Number of Transmit Buffers: 1; Number of Receive Buffers: 1; Radiation Hardening: No; Lead Free: Lead Free; REACH SVHC: No SVHC; ComponentLink1URL: https://datasheet.ciiva.com/18624/tja1050-18624869.pdf?src-supplier=Digi-Key; ComponentLink1Description: https://datasheet.ciiva.com/18624/tja1050-18624869.pdf?src-supplier=Digi-Key; ComponentLink2URL: https://datasheet.ciiva.com/26933/getdatasheetpartid-747091-26933446.pdf?src-supplier=Verical; ComponentLink2Description: https://datasheet.ciiva.com/26933/getdatasheetpartid-747091-26933446.pdf?src-supplier=Verical; ComponentLink3URL: https://datasheet.ciiva.com/29891/tja1050-29891527.pdf?src-supplier=Avnet; ComponentLink3Description: https://datasheet.ciiva.com/29891/tja1050-29891527.pdf?src-supplier=Avnet; ComponentLink4URL: https://datasheet.ciiva.com/24191/tja1050-24191228.pdf?src-supplier=Future+Electronics; ComponentLink4Description: https://datasheet.ciiva.com/24191/tja1050-24191228.pdf?src-supplier=Future+Electronics; Supplier 2: Digi-Key; Supplier Part Number 2: 568-10292-1-ND; Stock 2: 109237; Pricing 2: 1=1.22000, 10=1.09200, 25=1.03600, 100=0.79550, 250=0.70300, 500=0.66600, 1000=0.51800 (USD)
Y1 = CMP-36405-000005-1: CRYSTAL 16.00 MHZ 9PF SMD; Manufacturer Part Number: TSX-3225 16.0000MF18X-AC0; Manufacturer: EPSON; Stability: 18ppm; Esr: 60Ω; Tolerance: 10ppm; ESR (Equivalent Series Resistance): 60R; Series: TSX-3225; Temperature Range High: +85°C; ComponentLink2URL: https://support.epson.biz/td/api/doc_check.php?dl=brief_TSX-3225&lang=en; Temperature Range Low: -40°C; RoHS: TRUE; Lead Free: Yes; Mouser Description: CRYSTAL 16.00 MHZ 9PF SMD; Category: Crys; Temperature: -40°C to +85°C; Device Class L1: Passive Components; Height: 0.6mm; Octopart: https://octopart.com/tsx-3225+16.0000mf18x-ac0-epson-58756552; Automotive: No; Frequency: 16MHz; Digikey Description: CRYSTAL 16.00 MHZ 9PF SMD; ComponentLink2Description: Datasheet; Load Capacitance: 9pF; Package: TSX-3225; Device Class L3: Crystals; Device Class L2: Crystals / Oscillators; Supplier Part Number 1: C13738; Supplier 1: LCSC; Supplier 2: Digi-Key; Supplier Part Number 2: SER4070CT-ND; Stock 2: 5903; Pricing 2: 1=0.33000, 10=0.27500, 50=0.24760, 100=0.22000, 500=0.20900 (USD); Mount: Surface Mount; Case/Package: SMD/SMT; Min Operating Temperature: -20°C; Max Operating Temperature: 75°C; Packaging: Tape and Reel; Frequency Stability: 18ppm; Frequency Tolerance: 10ppm; Length: 0.126inch; Width: 0.098inch; ComponentLink1URL: https://www.eea.epson.com/wp-content/uploads/2016/11/November-2016-PCS-MASTER-BOOK.pdf?src-supplier=Verical; ComponentLink1Description: https://www.eea.epson.com/wp-content/uploads/2016/11/November-2016-PCS-MASTER-BOOK.pdf?src-supplier=Verical; ComponentLink3URL: https://www5.epsondevice.com/en/information/support/pdf/june_2018_psc_masterbook.pdf?src-supplier=Digi-Key; ComponentLink3Description: https://www5.epsondevice.com/en/information/support/pdf/june_2018_psc_masterbook.pdf?src-supplier=Digi-Key; ComponentLink4URL: https://www.eea.epson.com/wp-content/uploads/2016/11/November-2016-PCS-MASTER-BOOK.pdf?src-supplier=Mouser; ComponentLink4Description: https://www.eea.epson.com/wp-content/uploads/2016/11/November-2016-PCS-MASTER-BOOK.pdf?src-supplier=Mouser; ComponentLink5URL: https://www.eea.epson.com/wp-content/uploads/2016/11/November-2016-PCS-MASTER-BOOK.pdf?src-supplier=Dove; ComponentLink5Description: https://www.eea.epson.com/wp-content/uploads/2016/11/November-2016-PCS-MASTER-BOOK.pdf?src-supplier=Dove